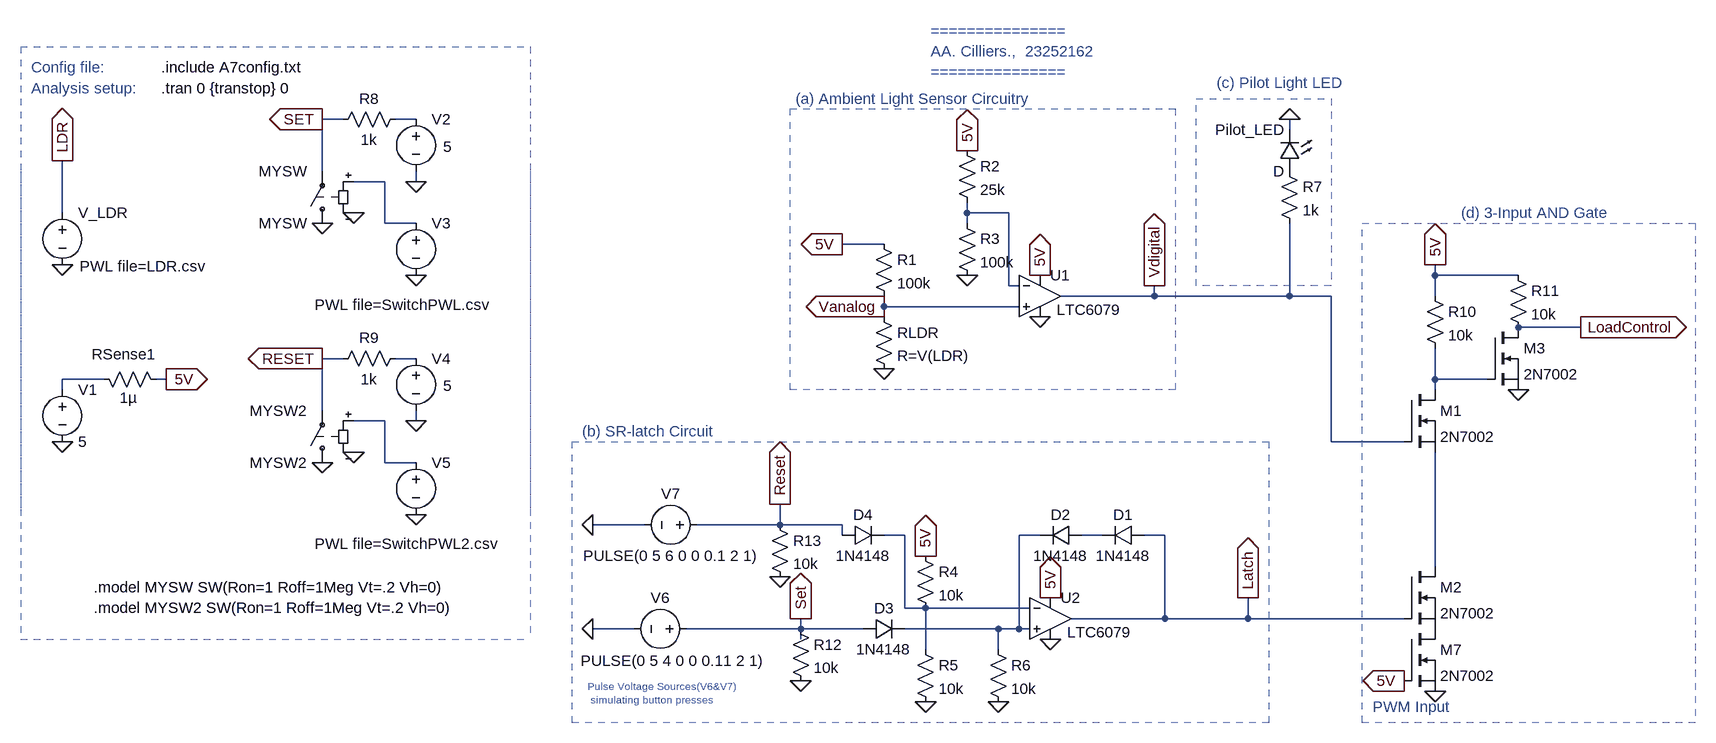
[diagram p0: schematic E344_23252162_A7.asc]
E344_23252162_A7.asc, the LTspice schematic file:
Version 4
SHEET 1 1824 680
WIRE -1872 -1312 -1904 -1312
WIRE -1760 -1312 -1792 -1312
WIRE -416 -1296 -416 -1312
WIRE -1904 -1232 -1904 -1312
WIRE -1808 -1216 -1856 -1216
WIRE -1760 -1216 -1760 -1232
WIRE -2304 -1168 -2304 -1248
WIRE -912 -1168 -912 -1184
WIRE -848 -1168 -912 -1168
WIRE -1808 -1152 -1808 -1216
WIRE -1760 -1152 -1808 -1152
WIRE -912 -1152 -912 -1168
WIRE -1040 -1120 -1104 -1120
WIRE -192 -1072 -192 -1088
WIRE -64 -1072 -192 -1072
WIRE -848 -1056 -848 -1168
WIRE -832 -1056 -848 -1056
WIRE -624 -1040 -624 -1056
WIRE -624 -1040 -768 -1040
WIRE -416 -1040 -416 -1152
WIRE -416 -1040 -624 -1040
WIRE -352 -1040 -416 -1040
WIRE -192 -1040 -192 -1072
WIRE -1040 -1024 -1040 -1040
WIRE -832 -1024 -1040 -1024
WIRE -1040 -1008 -1040 -1024
WIRE 32 -992 -64 -992
WIRE -1872 -944 -1904 -944
WIRE -1760 -944 -1792 -944
WIRE -2240 -912 -2304 -912
WIRE -2144 -912 -2160 -912
WIRE -192 -912 -192 -960
WIRE -112 -912 -192 -912
WIRE -2304 -896 -2304 -912
WIRE -192 -896 -192 -912
WIRE -1904 -864 -1904 -944
WIRE -1808 -848 -1856 -848
WIRE -1760 -848 -1760 -864
WIRE -352 -816 -352 -1040
WIRE -240 -816 -352 -816
WIRE -1808 -784 -1808 -848
WIRE -1760 -784 -1808 -784
WIRE -1408 -688 -1488 -688
WIRE -1200 -688 -1200 -720
WIRE -1200 -688 -1328 -688
WIRE -1104 -688 -1200 -688
WIRE -1104 -672 -1104 -688
WIRE -1008 -672 -1040 -672
WIRE -800 -672 -832 -672
WIRE -704 -672 -736 -672
WIRE -608 -672 -640 -672
WIRE -192 -624 -192 -800
WIRE -1008 -560 -1008 -672
WIRE -976 -560 -1008 -560
WIRE -816 -560 -976 -560
WIRE -608 -544 -608 -672
WIRE -608 -544 -752 -544
WIRE -480 -544 -480 -576
WIRE -480 -544 -608 -544
WIRE -240 -544 -480 -544
WIRE -1424 -528 -1488 -528
WIRE -1168 -528 -1168 -544
WIRE -1168 -528 -1344 -528
WIRE -1072 -528 -1168 -528
WIRE -864 -528 -1008 -528
WIRE -832 -528 -832 -672
WIRE -832 -528 -864 -528
WIRE -816 -528 -832 -528
WIRE -1168 -512 -1168 -528
WIRE -976 -496 -976 -560
WIRE -864 -496 -864 -528
FLAG -800 -1008 0
FLAG -2304 -1088 0
FLAG -2304 -1248 LDR
IOPIN -2304 -1248 Out
FLAG -1040 -928 0
FLAG -800 -1072 5V
IOPIN -800 -1072 Out
FLAG -2144 -912 5V
IOPIN -2144 -912 Out
FLAG -2304 -816 0
FLAG -912 -1264 5V
IOPIN -912 -1264 Out
FLAG -912 -1072 0
FLAG -624 -1056 Vdigital
IOPIN -624 -1056 Out
FLAG -1040 -1024 Vanalog
IOPIN -1040 -1024 Out
FLAG -1104 -1120 5V
IOPIN -1104 -1120 Out
FLAG -976 -416 0
FLAG -976 -640 5V
IOPIN -976 -640 Out
FLAG -864 -416 0
FLAG -416 -1312 0
FLAG -1760 -1216 0
FLAG -1856 -1168 0
FLAG -1760 -1072 0
FLAG -1904 -1152 0
FLAG -1904 -1312 SET
IOPIN -1904 -1312 Out
FLAG -1760 -848 0
FLAG -1856 -800 0
FLAG -1760 -704 0
FLAG -1904 -784 0
FLAG -1904 -944 RESET
IOPIN -1904 -944 Out
FLAG -480 -576 Latch
IOPIN -480 -576 Out
FLAG -64 -896 0
FLAG -192 -1088 5V
IOPIN -192 -1088 Out
FLAG 32 -992 LoadControl
IOPIN 32 -992 Out
FLAG -240 -448 5V
IOPIN -240 -448 Out
FLAG -192 -432 0
FLAG -1200 -608 0
FLAG -1168 -448 0
FLAG -784 -576 5V
IOPIN -784 -576 Out
FLAG -784 -512 0
FLAG -1488 -528 0
FLAG -1488 -688 0
FLAG -1200 -720 Reset
IOPIN -1200 -720 Out
FLAG -1168 -544 Set
IOPIN -1168 -544 Out
SYMBOL voltage -2304 -1184 R0
WINDOW 123 0 0 Left 0
WINDOW 39 0 0 Left 0
WINDOW 3 27 98 Left 2
SYMATTR Value PWL file=LDR.csv
SYMATTR InstName V_LDR
SYMBOL OpAmps\\LTC6079 -800 -1040 R0
WINDOW 3 26 21 Left 2
SYMATTR InstName U1
SYMBOL res -1056 -1136 R0
SYMATTR InstName R1
SYMATTR Value 100k
SYMBOL res -1056 -1024 R0
SYMATTR InstName RLDR
SYMATTR Value R=V(LDR)
SYMBOL voltage -2304 -912 R0
WINDOW 123 0 0 Left 0
WINDOW 39 0 0 Left 0
SYMATTR InstName V1
SYMATTR Value 5
SYMBOL res -2256 -928 M90
WINDOW 0 -7 47 VBottom 2
WINDOW 3 29 54 VTop 2
SYMATTR InstName RSense1
SYMATTR Value 1µ
SYMBOL res -928 -1280 R0
SYMATTR InstName R2
SYMATTR Value 25k
SYMBOL res -928 -1168 R0
SYMATTR InstName R3
SYMATTR Value 100k
SYMBOL diode -1072 -512 R270
WINDOW 0 32 32 VTop 2
WINDOW 3 0 32 VBottom 2
SYMATTR InstName D3
SYMATTR Value 1N4148
SYMBOL LED -400 -1232 R180
WINDOW 0 24 64 Left 2
WINDOW 3 24 0 Left 2
SYMATTR InstName Pilot_LED
SYMBOL diode -1104 -656 R270
WINDOW 0 32 32 VTop 2
WINDOW 3 0 32 VBottom 2
SYMATTR InstName D4
SYMATTR Value 1N4148
SYMBOL OpAmps\\LTC6079 -784 -544 R0
WINDOW 3 26 21 Left 2
SYMATTR InstName U2
SYMBOL diode -736 -688 R90
WINDOW 0 0 32 VBottom 2
WINDOW 3 32 32 VTop 2
SYMATTR InstName D2
SYMATTR Value 1N4148
SYMBOL diode -640 -688 R90
WINDOW 0 0 32 VBottom 2
WINDOW 3 32 32 VTop 2
SYMATTR InstName D1
SYMATTR Value 1N4148
SYMBOL res -992 -656 R0
SYMATTR InstName R4
SYMATTR Value 10k
SYMBOL res -992 -512 R0
SYMATTR InstName R5
SYMATTR Value 10k
SYMBOL res -880 -512 R0
SYMATTR InstName R6
SYMATTR Value 10k
SYMBOL res -432 -1248 R0
SYMATTR InstName R7
SYMATTR Value 1k
SYMBOL sw -1904 -1136 R180
SYMATTR InstName MYSW
SYMATTR Value MYSW
SYMBOL voltage -1760 -1328 R0
WINDOW 3 42 58 Left 2
WINDOW 123 0 0 Left 0
WINDOW 39 0 0 Left 0
SYMATTR Value 5
SYMATTR InstName V2
SYMBOL voltage -1760 -1168 R0
WINDOW 3 -156 141 Left 2
WINDOW 123 0 0 Left 0
WINDOW 39 0 0 Left 0
SYMATTR Value PWL file=SwitchPWL.csv
SYMATTR InstName V3
SYMBOL res -1776 -1328 R90
WINDOW 0 0 56 VBottom 2
WINDOW 3 32 56 VTop 2
SYMATTR InstName R8
SYMATTR Value 1k
SYMBOL sw -1904 -768 R180
SYMATTR InstName MYSW2
SYMATTR Value MYSW2
SYMBOL voltage -1760 -960 R0
WINDOW 3 42 58 Left 2
WINDOW 123 0 0 Left 0
WINDOW 39 0 0 Left 0
SYMATTR Value 5
SYMATTR InstName V4
SYMBOL voltage -1760 -800 R0
WINDOW 3 -156 141 Left 2
WINDOW 123 0 0 Left 0
WINDOW 39 0 0 Left 0
SYMATTR Value PWL file=SwitchPWL2.csv
SYMATTR InstName V5
SYMBOL res -1776 -960 R90
WINDOW 0 0 56 VBottom 2
WINDOW 3 32 56 VTop 2
SYMATTR InstName R9
SYMATTR Value 1k
SYMBOL nmos -240 -896 R0
SYMATTR InstName M1
SYMATTR Value 2N7002
SYMBOL nmos -240 -624 R0
SYMATTR InstName M2
SYMATTR Value 2N7002
SYMBOL res -208 -1056 R0
SYMATTR InstName R10
SYMATTR Value 10k
SYMBOL res -80 -1088 R0
SYMATTR InstName R11
SYMATTR Value 10k
SYMBOL nmos -112 -992 R0
SYMATTR InstName M3
SYMATTR Value 2N7002
SYMBOL nmos -240 -528 R0
SYMATTR InstName M7
SYMATTR Value 2N7002
SYMBOL res -1184 -544 R0
SYMATTR InstName R12
SYMATTR Value 10k
SYMBOL res -1216 -704 R0
SYMATTR InstName R13
SYMATTR Value 10k
SYMBOL voltage -1328 -528 R90
WINDOW 0 -32 56 VBottom 2
WINDOW 3 33 37 VTop 2
WINDOW 123 0 0 Left 0
WINDOW 39 0 0 Left 0
SYMATTR InstName V6
SYMATTR Value PULSE(0 5 4 0 0 0.11 2 1)
SYMBOL voltage -1312 -688 R90
WINDOW 0 -32 56 VBottom 2
WINDOW 3 32 56 VTop 2
WINDOW 123 0 0 Left 0
WINDOW 39 0 0 Left 0
SYMATTR InstName V7
SYMATTR Value PULSE(0 5 6 0 0 0.1 2 1)
TEXT -2152 -1360 Left 2 !.tran 0 {transtop} 0
TEXT -2152 -1392 Left 2 !.include A7config.txt
TEXT -2352 -1392 Left 2 ;Config file:
TEXT -2352 -1360 Left 2 ;Analysis setup:
TEXT -968 -1448 Left 2 ;===============\nAA. Cilliers.,  23252162\n===============
TEXT -2256 -592 Left 2 !.model MYSW SW(Ron=1 Roff=1Meg Vt=.2 Vh=0)\n.model MYSW2 SW(Ron=1 Roff=1Meg Vt=.2 Vh=0)
TEXT -1176 -1344 Left 2 ;(a) Ambient Light Sensor Circuitry
TEXT -1504 -832 Left 2 ;(b) SR-latch Circuit
TEXT -1496 -440 Left 1 ;Pulse Voltage Sources(V6&V7)\n simulating button presses
TEXT -528 -1368 Left 2 ;(c) Pilot Light LED
TEXT -152 -1168 Left 2 ;(d) 3-Input AND Gate
TEXT -288 -408 Left 2 ;PWM Input
LINE Normal -1584 -1424 -1584 -704 2
LINE Normal -2368 -1424 -1584 -1424 2
LINE Normal -2368 -1424 -2368 -704 2
LINE Normal -2368 -1232 -2368 -512 2
LINE Normal -2368 -512 -1584 -512 2
LINE Normal -1584 -1232 -1584 -512 2
RECTANGLE Normal -592 -896 -1184 -1328 2
RECTANGLE Normal -448 -384 -1520 -816 2
RECTANGLE Normal -352 -1056 -560 -1344 2
RECTANGLE Normal 208 -384 -304 -1152 2

The netlist it stands for:
* E344_23252162_A7.asc
V_LDR LDR 0 PWL file=LDR.csv
XU1 Vanalog N003 5V 0 Vdigital LTC6078  ; LTC6079, pins In+ In- V+ V- OUT
R1 5V Vanalog 100k
RLDR Vanalog 0 R=V(LDR)
V1 N005 0 5
RSense1 N005 5V 1µ
R2 5V N003 25k
R3 N003 0 100k
D3 SET N009 1N4148
D§Pilot_LED P001 0 D
D4 RESET N008 1N4148
XU2 N009 N008 5V 0 Latch LTC6078  ; LTC6079, pins In+ In- V+ V- OUT
D2 N010 N009 1N4148
D1 Latch N010 1N4148
R4 5V N008 10k
R5 N008 0 10k
R6 N009 0 10k
R7 P001 Vdigital 1k
S§MYSW 0 SET N002 0 MYSW
V2 N001 0 5
V3 N002 0 PWL file=SwitchPWL.csv
R8 N001 SET 1k
S§MYSW2 0 RESET N007 0 MYSW2
V4 N004 0 5
V5 N007 0 PWL file=SwitchPWL2.csv
R9 N004 RESET 1k
M1 N006 Vdigital N011 N011 2N7002
M2 N011 Latch P002 P002 2N7002
R10 5V N006 10k
R11 5V LoadControl 10k
M3 LoadControl N006 0 0 2N7002
M7 P002 5V 0 0 2N7002
R12 SET 0 10k
R13 RESET 0 10k
V6 SET 0 PULSE(0 5 4 0 0 0.11 2 1)
V7 RESET 0 PULSE(0 5 6 0 0 0.1 2 1)
.model D D
.lib standard.dio
.model NMOS NMOS
.model PMOS PMOS
.lib standard.mos
.tran 0 {transtop} 0
.include A7config.txt
* Config file:
* Analysis setup:
* ===============
* AA. Cilliers.,  23252162
* ===============
.model MYSW SW(Ron=1 Roff=1Meg Vt=.2 Vh=0)
.model MYSW2 SW(Ron=1 Roff=1Meg Vt=.2 Vh=0)
* (a) Ambient Light Sensor Circuitry
* (b) SR-latch Circuit
* Pulse Voltage Sources(V6&V7)
*  simulating button presses
* (c) Pilot Light LED
* (d) 3-Input AND Gate
* PWM Input
.lib LTC5.lib
.backanno
.end